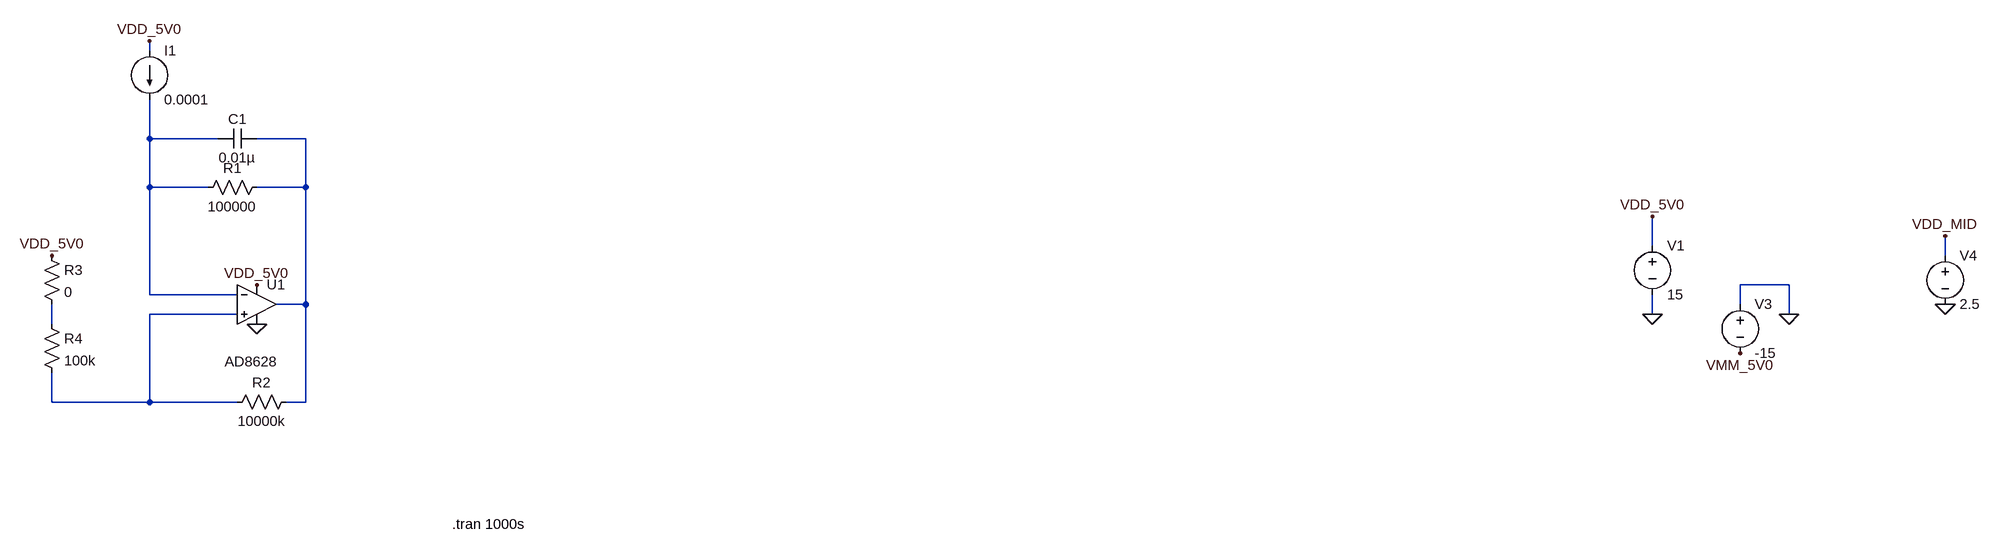
[diagram p0: schematic front_end_ohms_alt1.asc]
front_end_ohms_alt1.asc, the LTspice schematic file:
Version 4
SHEET 1 2288 680
WIRE -720 -560 -720 -576
WIRE -720 -416 -720 -480
WIRE -608 -416 -720 -416
WIRE -464 -416 -544 -416
WIRE -720 -336 -720 -416
WIRE -624 -336 -720 -336
WIRE -464 -336 -464 -416
WIRE -464 -336 -544 -336
WIRE 1744 -240 1744 -288
WIRE 2224 -224 2224 -256
WIRE 1968 -176 1888 -176
WIRE -720 -160 -720 -336
WIRE -576 -160 -720 -160
WIRE -464 -144 -464 -336
WIRE -464 -144 -512 -144
WIRE 1888 -144 1888 -176
WIRE -576 -128 -720 -128
WIRE 1744 -128 1744 -160
WIRE 1968 -128 1968 -176
WIRE -880 -112 -880 -144
WIRE -880 16 -880 -32
WIRE -720 16 -720 -128
WIRE -720 16 -880 16
WIRE -576 16 -720 16
WIRE -464 16 -464 -144
WIRE -464 16 -496 16
FLAG 1744 -288 VDD_5V0
FLAG 1744 -128 0
FLAG 1968 -128 0
FLAG 1888 -64 VMM_5V0
FLAG 2224 -256 VDD_MID
FLAG 2224 -144 0
FLAG -544 -112 0
FLAG -544 -176 VDD_5V0
FLAG -720 -576 VDD_5V0
FLAG -880 -224 VDD_5V0
SYMBOL voltage 1744 -256 R0
WINDOW 123 0 0 Left 0
WINDOW 39 0 0 Left 0
SYMATTR InstName V1
SYMATTR Value 15
SYMBOL voltage 1888 -160 R0
WINDOW 123 0 0 Left 0
WINDOW 39 0 0 Left 0
SYMATTR InstName V3
SYMATTR Value -15
SYMBOL voltage 2224 -240 R0
WINDOW 123 0 0 Left 0
WINDOW 39 0 0 Left 0
SYMATTR InstName V4
SYMATTR Value 2.5
SYMBOL current -720 -560 R0
WINDOW 123 0 0 Left 0
WINDOW 39 0 0 Left 0
SYMATTR InstName I1
SYMATTR Value 0.0001
SYMBOL Opamps\\AD8628 -544 -208 R0
WINDOW 3 -53 158 Left 2
SYMATTR InstName U1
SYMBOL res -528 -352 R90
WINDOW 0 0 56 VBottom 2
WINDOW 3 32 56 VTop 2
SYMATTR InstName R1
SYMATTR Value 100000
SYMBOL cap -544 -432 R90
WINDOW 0 0 32 VBottom 2
WINDOW 3 32 32 VTop 2
SYMATTR InstName C1
SYMATTR Value 0.01µ
SYMBOL res -480 0 R90
WINDOW 0 0 56 VBottom 2
WINDOW 3 32 56 VTop 2
SYMATTR InstName R2
SYMATTR Value 10000k
SYMBOL res -896 -240 R0
SYMATTR InstName R3
SYMATTR Value 0
SYMBOL res -896 -128 R0
SYMATTR InstName R4
SYMATTR Value 100k
TEXT -224 216 Left 2 !.tran 1000s

The netlist it stands for:
* front_end_ohms_alt1.asc
V1 VDD_5V0 0 15
V3 0 VMM_5V0 -15
V4 VDD_MID 0 2.5
I1 VDD_5V0 N001 0.0001
XU1 N003 N001 VDD_5V0 0 N002 AD8628  ; pins In+ In- V+ V- OUT
R1 N002 N001 100000
C1 N002 N001 0.01µ
R2 N002 N003 10000k
R3 VDD_5V0 N004 0
R4 N004 N003 100k
.tran 1000s
.backanno
.end